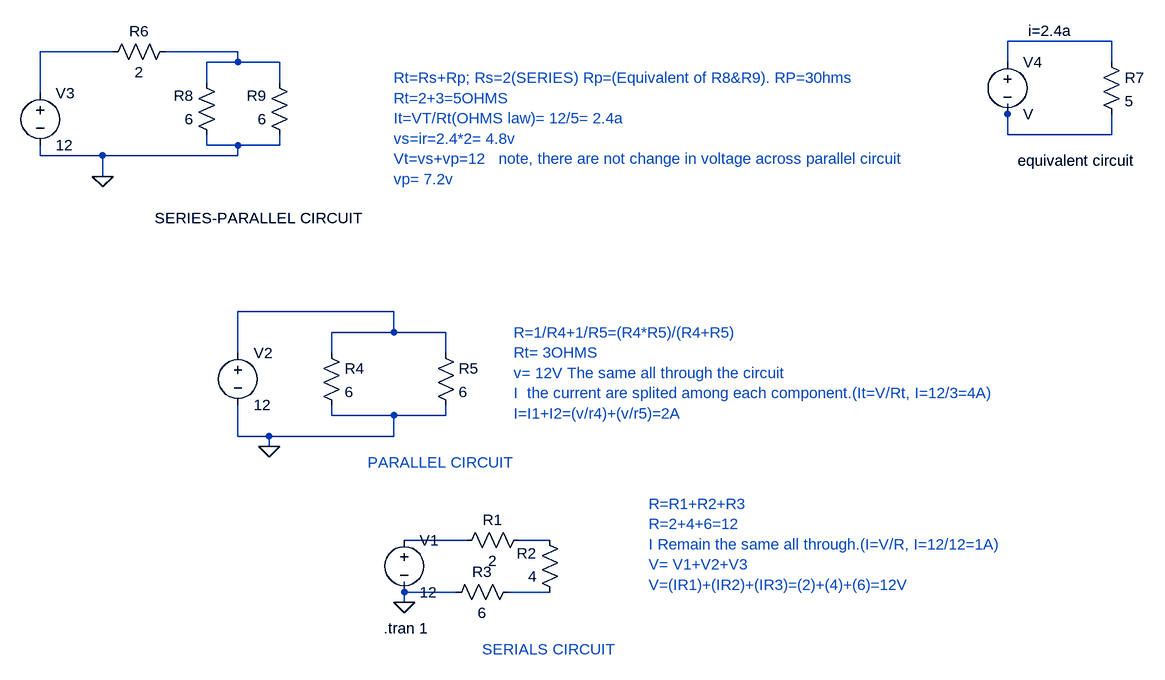
[diagram p0: schematic Draft3  S.asc]
Draft3  S.asc, the LTspice schematic file:
Version 4.1
SHEET 1 1100 680
WIRE 1040 -640 880 -640
WIRE -496 -624 -608 -624
WIRE -304 -624 -416 -624
WIRE -304 -608 -304 -624
WIRE -304 -608 -352 -608
WIRE -240 -608 -304 -608
WIRE 880 -608 880 -640
WIRE 1040 -608 1040 -640
WIRE -352 -576 -352 -608
WIRE -240 -576 -240 -608
WIRE -608 -560 -608 -624
WIRE 880 -528 880 -544
WIRE 880 -496 880 -528
WIRE 1040 -496 1040 -528
WIRE 1040 -496 880 -496
WIRE -352 -480 -352 -496
WIRE -304 -480 -352 -480
WIRE -240 -480 -240 -496
WIRE -240 -480 -304 -480
WIRE -608 -464 -608 -480
WIRE -512 -464 -608 -464
WIRE -304 -464 -304 -480
WIRE -304 -464 -512 -464
WIRE -512 -432 -512 -464
WIRE -64 -224 -304 -224
WIRE -64 -192 -64 -224
WIRE -64 -192 -160 -192
WIRE 16 -192 -64 -192
WIRE -304 -160 -304 -224
WIRE -160 -160 -160 -192
WIRE 16 -160 16 -192
WIRE -160 -64 -160 -80
WIRE -64 -64 -160 -64
WIRE 16 -64 16 -80
WIRE 16 -64 -64 -64
WIRE -304 -32 -304 -80
WIRE -256 -32 -304 -32
WIRE -64 -32 -64 -64
WIRE -64 -32 -256 -32
WIRE -256 -16 -256 -32
WIRE 48 128 -48 128
WIRE 176 128 128 128
WIRE -48 208 -48 192
WIRE 32 208 -48 208
WIRE 176 208 112 208
WIRE -48 224 -48 208
FLAG -48 224 0
FLAG -512 -432 0
FLAG -256 -16 0
SYMBOL voltage -48 112 R0
WINDOW 123 0 0 Left 0
WINDOW 39 0 0 Left 0
SYMATTR InstName V1
SYMATTR Value 12
SYMBOL res 144 112 R90
WINDOW 0 0 56 VBottom 2
WINDOW 3 32 56 VTop 2
SYMATTR InstName R1
SYMATTR Value 2
SYMBOL res 192 224 R180
WINDOW 0 36 76 Left 2
WINDOW 3 36 40 Left 2
SYMATTR InstName R2
SYMATTR Value 4
SYMBOL res 16 224 R270
WINDOW 0 32 56 VTop 2
WINDOW 3 0 56 VBottom 2
SYMATTR InstName R3
SYMATTR Value 6
SYMBOL voltage -304 -176 R0
SYMATTR InstName V2
SYMATTR Value 12
SYMBOL res -176 -176 R0
SYMATTR InstName R4
SYMATTR Value 6
SYMBOL res 0 -176 R0
SYMATTR InstName R5
SYMATTR Value 6
SYMBOL res -336 -480 R180
WINDOW 0 36 76 Left 2
WINDOW 3 36 40 Left 2
SYMATTR InstName R8
SYMATTR Value 6
SYMBOL res -224 -480 R180
WINDOW 0 36 76 Left 2
WINDOW 3 36 40 Left 2
SYMATTR InstName R9
SYMATTR Value 6
SYMBOL voltage -608 -576 R0
SYMATTR InstName V3
SYMATTR Value 12
SYMBOL res -400 -640 R90
WINDOW 0 0 56 VBottom 2
WINDOW 3 32 56 VTop 2
SYMATTR InstName R6
SYMATTR Value 2
SYMBOL voltage 880 -624 R0
SYMATTR InstName V4
SYMBOL res 1024 -624 R0
SYMATTR InstName R7
SYMATTR Value 5
TEXT -80 264 Left 2 !.tran 1
TEXT 328 72 Left 2 ;R=R1+R2+R3\nR=2+4+6=12\nI Remain the same all through.(I=V/R, I=12/12=1A)\nV= V1+V2+V3\nV=(IR1)+(IR2)+(IR3)=(2)+(4)+(6)=12V
TEXT 72 296 Left 2 ;SERIALS CIRCUIT
TEXT 120 -192 Left 2 ;R=1/R4+1/R5=(R4*R5)/(R4+R5)\nRt= 3OHMS\nv= 12V The same all through the circuit\nI  the current are splited among each component.(It=V/Rt, I=12/3=4A)\nI=I1+I2=(v/r4)+(v/r5)=2A
TEXT -104 8 Left 2 ;PARALLEL CIRCUIT
TEXT -432 -368 Left 2 !SERIES-PARALLEL CIRCUIT
TEXT -64 -584 Left 2 ;Rt=Rs+Rp; Rs=2(SERIES) Rp=(Equivalent of R8&R9). RP=30hms\nRt=2+3=5OHMS\nIt=VT/Rt(OHMS law)= 12/5= 2.4a\nvs=ir=2.4*2= 4.8v\nVt=vs+vp=12   note, there are not change in voltage across parallel circuit\nvp= 7.2v
TEXT 896 -456 Left 2 !equivalent circuit
TEXT 912 -656 Left 2 !i=2.4a

The netlist it stands for:
* Draft3  S.asc
V1 N006 0 12
R1 N007 N006 2
R2 N008 N007 4
R3 0 N008 6
V2 N005 0 12
R4 N005 0 6
R5 N005 0 6
R8 0 N003 6
R9 0 N003 6
V3 N002 0 12
R6 N003 N002 2
V4 N001 N004 V
R7 N001 N004 5
.tran 1
* R=R1+R2+R3
* R=2+4+6=12
* I Remain the same all through.(I=V/R, I=12/12=1A)
* V= V1+V2+V3
* V=(IR1)+(IR2)+(IR3)=(2)+(4)+(6)=12V
* SERIALS CIRCUIT
* R=1/R4+1/R5=(R4*R5)/(R4+R5)
* Rt= 3OHMS
* v= 12V The same all through the circuit
* I  the current are splited among each component.(It=V/Rt, I=12/3=4A)
* I=I1+I2=(v/r4)+(v/r5)=2A
* PARALLEL CIRCUIT
SERIES-PARALLEL CIRCUIT
* Rt=Rs+Rp; Rs=2(SERIES) Rp=(Equivalent of R8&R9). RP=30hms
* Rt=2+3=5OHMS
* It=VT/Rt(OHMS law)= 12/5= 2.4a
* vs=ir=2.4*2= 4.8v
* Vt=vs+vp=12   note, there are not change in voltage across parallel circuit
* vp= 7.2v
equivalent circuit
i=2.4a
.backanno
.end